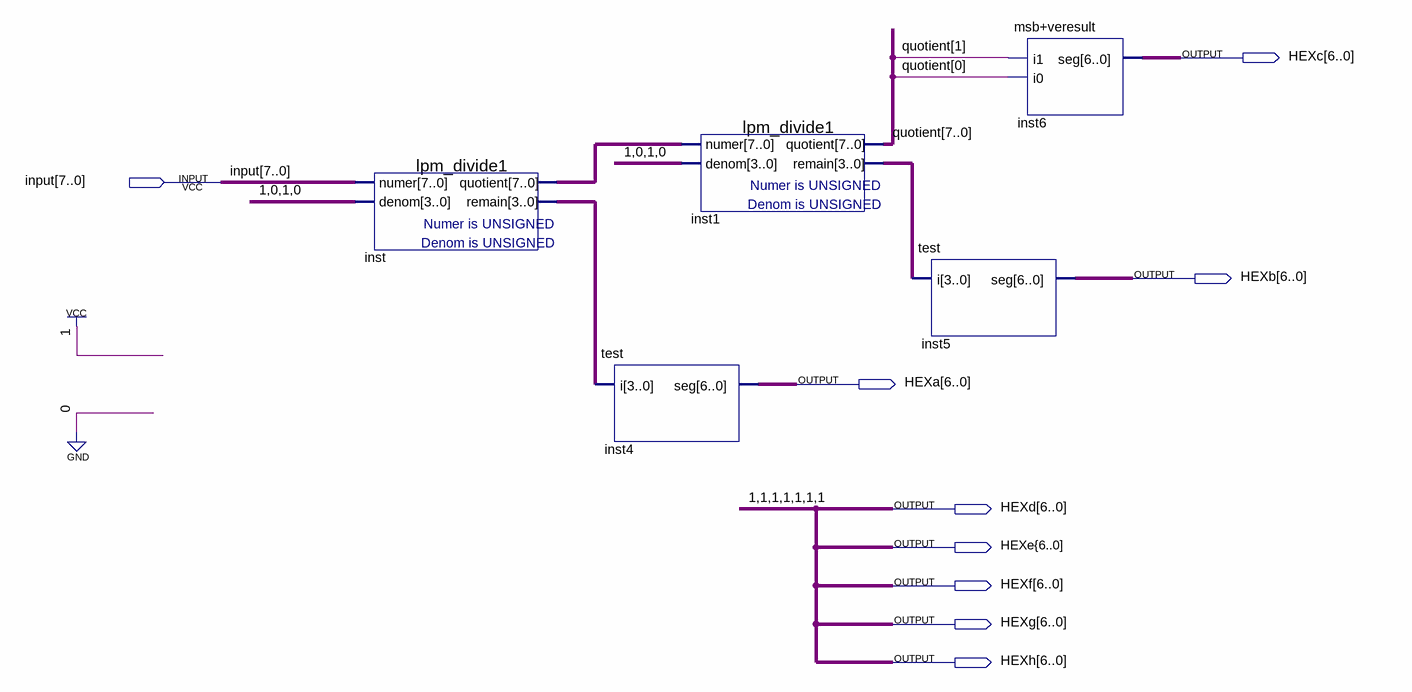
[diagram p0: schematic sheet]
// Quartus schematic +veaddmodule.bdf as structural Verilog: 5 symbols, 9 pins
module \+veaddmodule  (
  input  [7:0] \input ,
  output [6:0] HEXc,
  output [6:0] HEXb,
  output [6:0] HEXa,
  output [6:0] HEXd,
  output \HEXe{6..0] ,
  output [6:0] HEXf,
  output [6:0] HEXg,
  output [6:0] HEXh
);

  wire [3:0] inst1_remain, inst_remain;
  wire [7:0] inst_quotient, quotient;

  lpm_divide1 inst (.numer(\input ), .denom(4'b1010), .quotient(inst_quotient), .remain(inst_remain));
  test inst4 (.i(inst_remain), .seg(HEXa));
  lpm_divide1 inst1 (.numer(inst_quotient), .denom(4'b1010), .quotient(quotient), .remain(inst1_remain));
  test inst5 (.i(inst1_remain), .seg(HEXb));
  \msb+veresult  inst6 (.i1(quotient[1]), .i0(quotient[0]), .seg(HEXc));

  assign HEXd = {7{1'b1}};
  assign HEXf = {7{1'b1}};
  assign HEXg = {7{1'b1}};
  assign HEXh = {7{1'b1}};
endmodule
